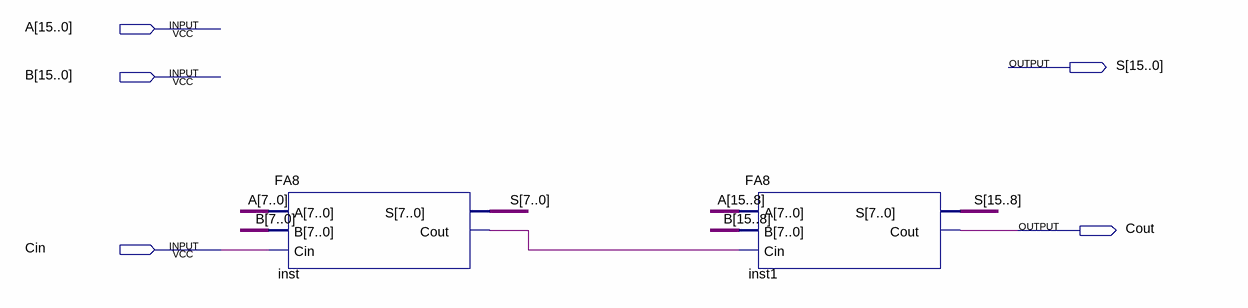
[diagram p0: schematic sheet]
// Quartus schematic FA16.bdf as structural Verilog: 2 symbols, 5 pins
module FA16 (
  input  [15:0] A,
  input  [15:0] B,
  input  Cin,
  output [15:0] S,
  output Cout
);

  wire inst_cout;

  FA8 inst (.A(A[7:0]), .B(B[7:0]), .Cin(Cin), .S(S[7:0]), .Cout(inst_cout));
  FA8 inst1 (.A(A[15:8]), .B(B[15:8]), .Cin(inst_cout), .S(S[15:8]), .Cout(Cout));
endmodule
